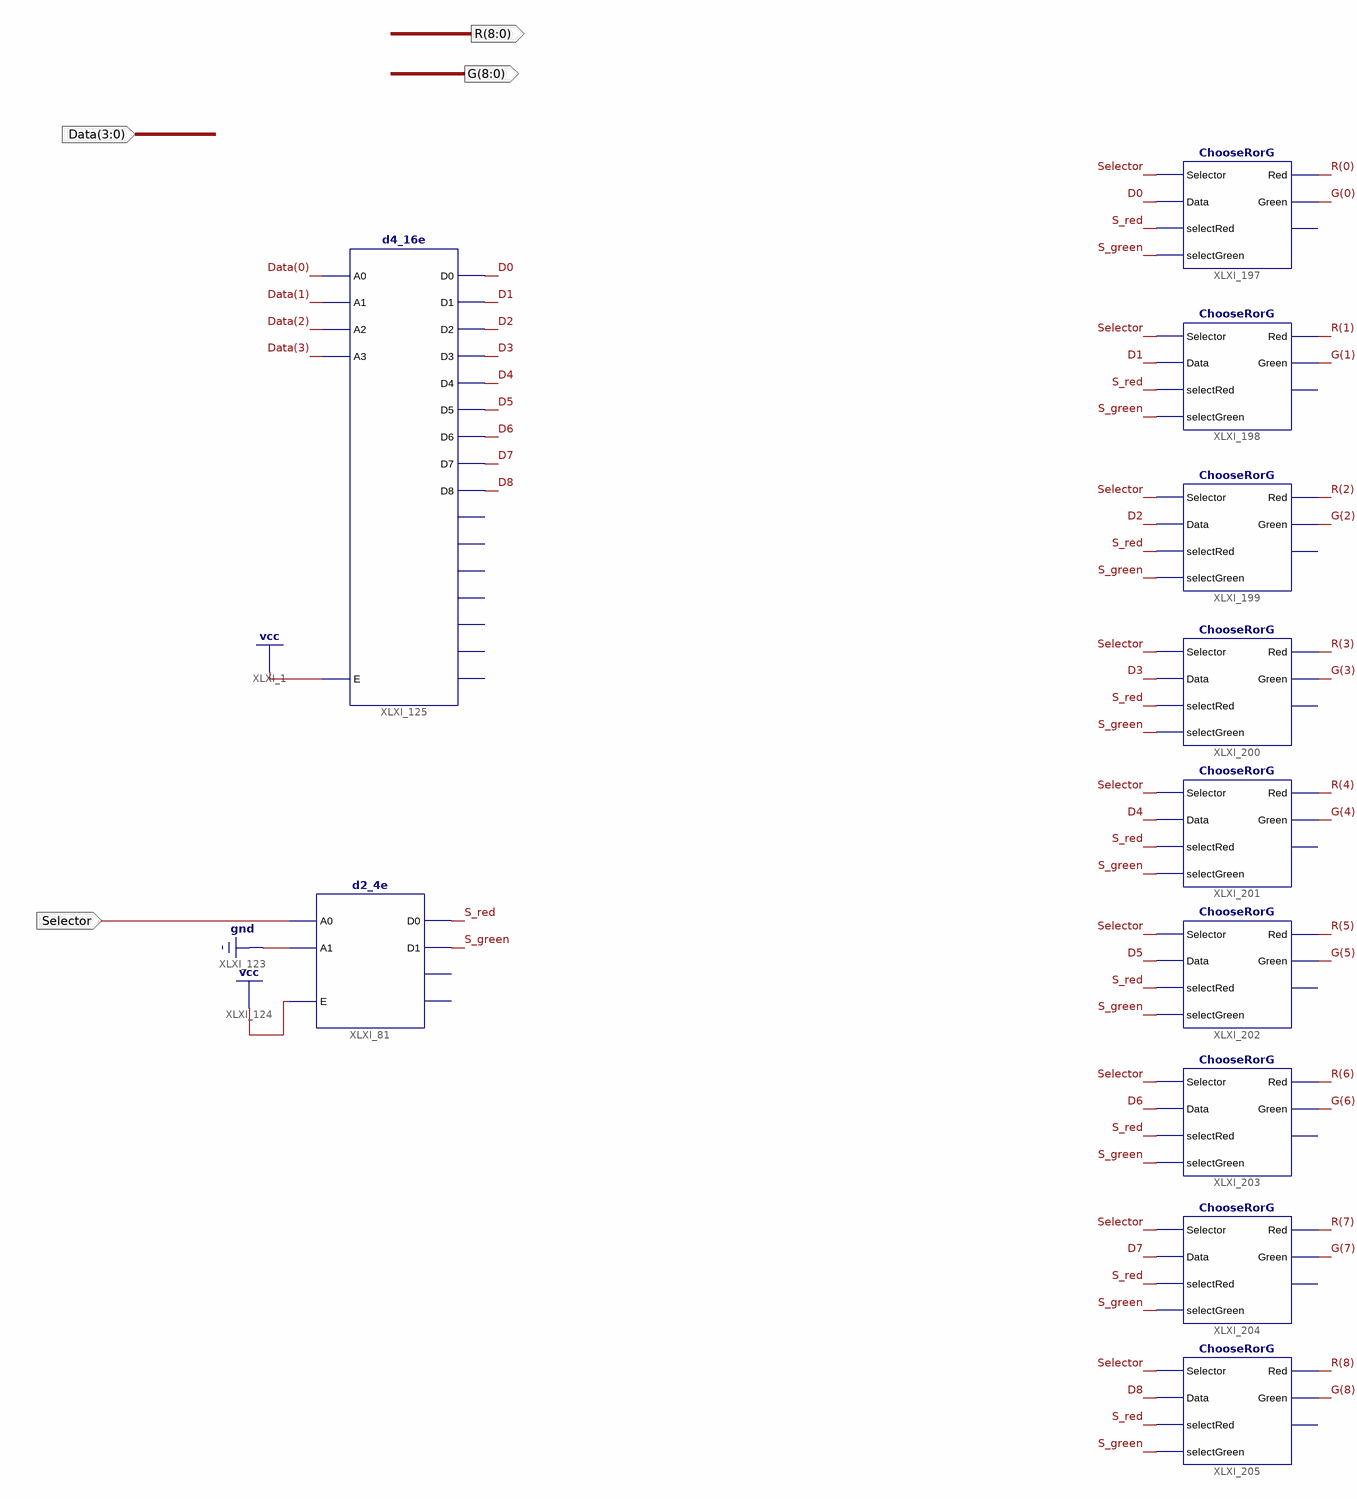
[diagram p0: schematic sheet 1]
// Xilinx ISE schematic LedWithLightSave.sch (spartan6) as structural Verilog: 11 symbols, 4 ports
module LedWithLightSave (
  input  Selector,
  input  [3:0] Data,
  output [8:0] R,
  output [8:0] G
);

  wire D0, D1, D2, D3, D4, D5, D6, D7, D8, S_green, S_red;

  d2_4e XLXI_81 (.A0(Selector), .A1(1'b0), .E(1'b1), .D0(S_red), .D1(S_green));  // open: D2, D3
  d4_16e XLXI_125 (
    .A0(Data[0]), .A1(Data[1]), .A2(Data[2]), .A3(Data[3]), .E(1'b1), .D0(D0), .D1(D1), .D2(D2), .D3(D3),
    .D4(D4), .D5(D5), .D6(D6), .D7(D7), .D8(D8));  // open: D10, D11, D12, D13, D14, D15, D9
  ChooseRorG XLXI_197 (
    .Data(D0), .Selector(Selector), .selectRed(S_red), .selectGreen(S_green), .Red(R[0]), .Green(G[0]));  // open: TC
  ChooseRorG XLXI_198 (
    .Data(D1), .Selector(Selector), .selectRed(S_red), .selectGreen(S_green), .Red(R[1]), .Green(G[1]));  // open: TC
  ChooseRorG XLXI_199 (
    .Data(D2), .Selector(Selector), .selectRed(S_red), .selectGreen(S_green), .Red(R[2]), .Green(G[2]));  // open: TC
  ChooseRorG XLXI_200 (
    .Data(D3), .Selector(Selector), .selectRed(S_red), .selectGreen(S_green), .Red(R[3]), .Green(G[3]));  // open: TC
  ChooseRorG XLXI_201 (
    .Data(D4), .Selector(Selector), .selectRed(S_red), .selectGreen(S_green), .Red(R[4]), .Green(G[4]));  // open: TC
  ChooseRorG XLXI_202 (
    .Data(D5), .Selector(Selector), .selectRed(S_red), .selectGreen(S_green), .Red(R[5]), .Green(G[5]));  // open: TC
  ChooseRorG XLXI_203 (
    .Data(D6), .Selector(Selector), .selectRed(S_red), .selectGreen(S_green), .Red(R[6]), .Green(G[6]));  // open: TC
  ChooseRorG XLXI_204 (
    .Data(D7), .Selector(Selector), .selectRed(S_red), .selectGreen(S_green), .Red(R[7]), .Green(G[7]));  // open: TC
  ChooseRorG XLXI_205 (
    .Data(D8), .Selector(Selector), .selectRed(S_red), .selectGreen(S_green), .Red(R[8]), .Green(G[8]));  // open: TC
endmodule
